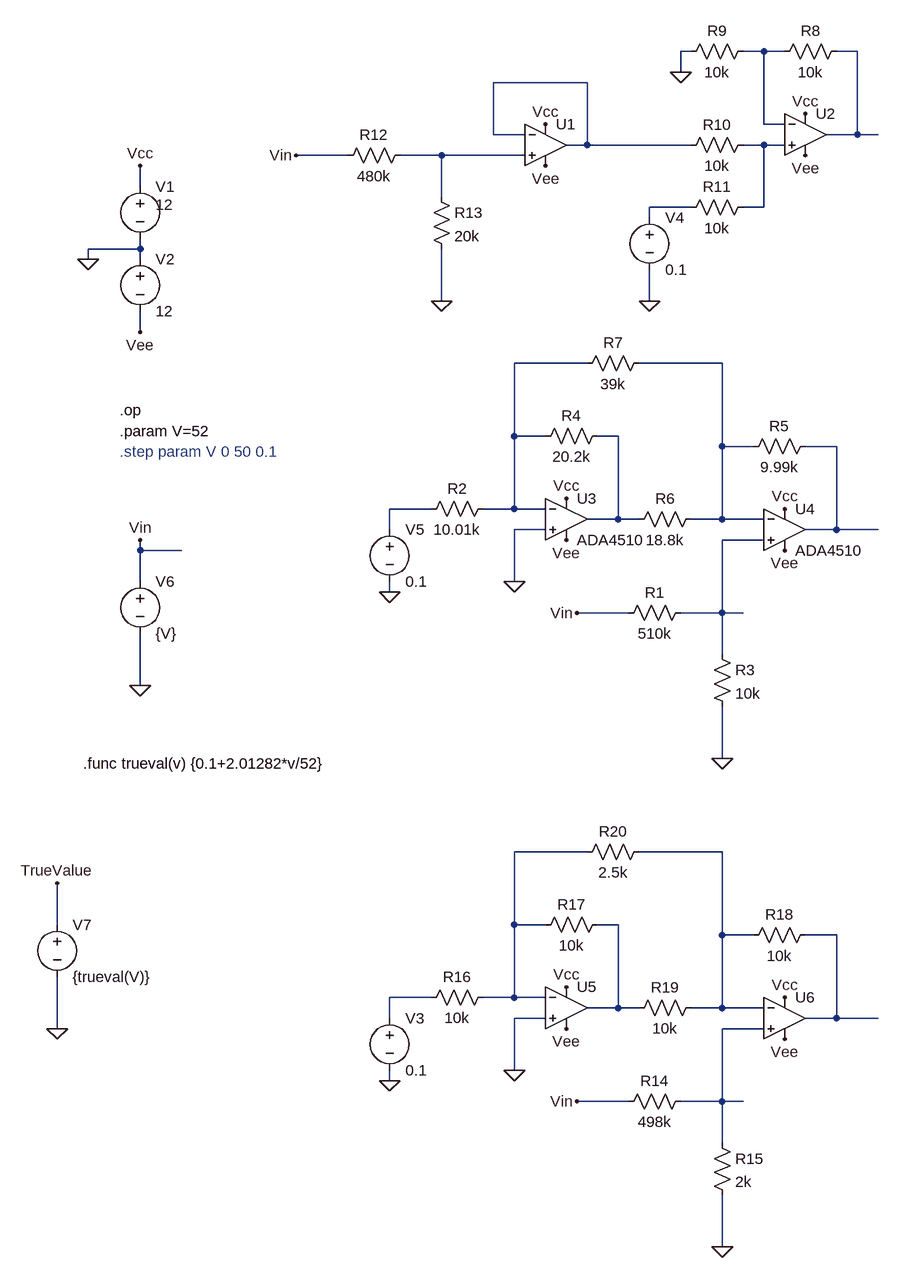
[diagram p0: schematic VoltMeas.asc]
VoltMeas.asc, the LTspice schematic file:
Version 4.1
SHEET 1 880 1684
WIRE -544 -176 -560 -176
WIRE -432 -176 -464 -176
WIRE -400 -176 -432 -176
WIRE -288 -176 -320 -176
WIRE -560 -144 -560 -176
WIRE -704 -128 -848 -128
WIRE -432 -64 -432 -176
WIRE -400 -64 -432 -64
WIRE -848 -48 -848 -128
WIRE -800 -48 -848 -48
WIRE -288 -48 -288 -176
WIRE -288 -48 -336 -48
WIRE -256 -48 -288 -48
WIRE -704 -32 -704 -128
WIRE -704 -32 -736 -32
WIRE -544 -32 -704 -32
WIRE -432 -32 -464 -32
WIRE -400 -32 -432 -32
WIRE -1072 -16 -1152 -16
WIRE -928 -16 -992 -16
WIRE -800 -16 -928 -16
WIRE -1392 32 -1392 0
WIRE -928 48 -928 -16
WIRE -544 64 -608 64
WIRE -432 64 -432 -32
WIRE -432 64 -464 64
WIRE -608 80 -608 64
WIRE -1392 128 -1392 112
WIRE -1392 128 -1472 128
WIRE -1472 144 -1472 128
WIRE -1392 144 -1392 128
WIRE -928 208 -928 128
WIRE -608 208 -608 160
WIRE -1392 256 -1392 224
WIRE -704 304 -816 304
WIRE -496 304 -624 304
WIRE -816 416 -816 304
WIRE -768 416 -816 416
WIRE -656 416 -688 416
WIRE -496 432 -496 304
WIRE -448 432 -496 432
WIRE -320 432 -368 432
WIRE -944 528 -1008 528
WIRE -816 528 -816 416
WIRE -816 528 -864 528
WIRE -768 528 -816 528
WIRE -656 544 -656 416
WIRE -656 544 -704 544
WIRE -624 544 -656 544
WIRE -496 544 -496 432
WIRE -496 544 -544 544
WIRE -432 544 -496 544
WIRE -1008 560 -1008 528
WIRE -768 560 -816 560
WIRE -320 560 -320 432
WIRE -320 560 -368 560
WIRE -256 560 -320 560
WIRE -432 576 -496 576
WIRE -1392 592 -1392 576
WIRE -1328 592 -1392 592
WIRE -1392 640 -1392 592
WIRE -816 640 -816 560
WIRE -1008 656 -1008 640
WIRE -640 688 -720 688
WIRE -496 688 -496 576
WIRE -496 688 -560 688
WIRE -464 688 -496 688
WIRE -496 752 -496 688
WIRE -1392 800 -1392 720
WIRE -496 912 -496 832
WIRE -704 1056 -816 1056
WIRE -496 1056 -624 1056
WIRE -1520 1168 -1520 1104
WIRE -816 1168 -816 1056
WIRE -768 1168 -816 1168
WIRE -656 1168 -688 1168
WIRE -496 1184 -496 1056
WIRE -448 1184 -496 1184
WIRE -320 1184 -368 1184
WIRE -944 1280 -1008 1280
WIRE -816 1280 -816 1168
WIRE -816 1280 -864 1280
WIRE -768 1280 -816 1280
WIRE -656 1296 -656 1168
WIRE -656 1296 -704 1296
WIRE -624 1296 -656 1296
WIRE -496 1296 -496 1184
WIRE -496 1296 -544 1296
WIRE -432 1296 -496 1296
WIRE -1008 1312 -1008 1280
WIRE -768 1312 -816 1312
WIRE -320 1312 -320 1184
WIRE -320 1312 -368 1312
WIRE -256 1312 -320 1312
WIRE -1520 1328 -1520 1248
WIRE -432 1328 -496 1328
WIRE -816 1392 -816 1312
WIRE -1008 1408 -1008 1392
WIRE -640 1440 -720 1440
WIRE -496 1440 -496 1328
WIRE -496 1440 -560 1440
WIRE -464 1440 -496 1440
WIRE -496 1504 -496 1440
WIRE -496 1664 -496 1584
FLAG -1472 144 0
FLAG -1392 0 Vcc
FLAG -1392 256 Vee
FLAG -768 -64 Vcc
FLAG -768 0 Vee
FLAG -496 912 0
FLAG -368 -80 Vcc
FLAG -368 -16 Vee
FLAG -560 -144 0
FLAG -608 208 0
FLAG -736 576 Vee
FLAG -400 592 Vee
FLAG -400 528 Vcc
FLAG -736 512 Vcc
FLAG -816 640 0
FLAG -1008 656 0
FLAG -1392 800 0
FLAG -928 208 0
FLAG -1392 576 Vin
FLAG -1152 -16 Vin
FLAG -720 688 Vin
FLAG -496 1664 0
FLAG -736 1328 Vee
FLAG -400 1344 Vee
FLAG -400 1280 Vcc
FLAG -736 1264 Vcc
FLAG -816 1392 0
FLAG -1008 1408 0
FLAG -720 1440 Vin
FLAG -1520 1104 TrueValue
FLAG -1520 1328 0
DATAFLAG -624 -32 ""
DATAFLAG -256 -48 ""
DATAFLAG -1328 592 ""
DATAFLAG -928 -16 ""
DATAFLAG -608 64 ""
DATAFLAG -256 560 ""
DATAFLAG -464 688 ""
DATAFLAG -1008 528 ""
DATAFLAG -256 1312 ""
DATAFLAG -464 1440 ""
DATAFLAG -1008 1280 ""
DATAFLAG -192 608 "V(truevalue)"
SYMBOL voltage -1392 16 R0
WINDOW 3 24 44 Left 2
WINDOW 123 0 0 Left 0
WINDOW 39 0 0 Left 0
SYMATTR Value 12
SYMATTR InstName V1
SYMBOL voltage -1392 128 R0
WINDOW 123 0 0 Left 0
WINDOW 39 0 0 Left 0
SYMATTR InstName V2
SYMATTR Value 12
SYMBOL res -544 672 R90
WINDOW 0 0 56 VBottom 2
WINDOW 3 32 56 VTop 2
SYMATTR InstName R1
SYMATTR Value 510k
SYMATTR SpiceLine tol=1
SYMBOL res -512 736 R0
SYMATTR InstName R3
SYMATTR Value 10k
SYMATTR SpiceLine tol=1
SYMBOL res -304 -192 R90
WINDOW 0 0 56 VBottom 2
WINDOW 3 32 56 VTop 2
SYMATTR InstName R8
SYMATTR Value 10k
SYMBOL res -448 -192 R90
WINDOW 0 0 56 VBottom 2
WINDOW 3 32 56 VTop 2
SYMATTR InstName R9
SYMATTR Value 10k
SYMBOL res -448 -48 R90
WINDOW 0 0 56 VBottom 2
WINDOW 3 32 56 VTop 2
SYMATTR InstName R10
SYMATTR Value 10k
SYMBOL res -448 48 R90
WINDOW 0 0 56 VBottom 2
WINDOW 3 32 56 VTop 2
SYMATTR InstName R11
SYMATTR Value 10k
SYMBOL voltage -608 64 R0
WINDOW 123 0 0 Left 0
WINDOW 39 0 0 Left 0
SYMATTR InstName V4
SYMATTR Value 0.1
SYMBOL Res -848 512 R90
WINDOW 0 0 56 VBottom 2
WINDOW 3 32 56 VTop 2
SYMATTR InstName R2
SYMATTR Value 10.01k
SYMBOL Res -672 400 R90
WINDOW 0 0 56 VBottom 2
WINDOW 3 32 56 VTop 2
SYMATTR InstName R4
SYMATTR Value 20.2k
SYMBOL Res -352 416 R90
WINDOW 0 0 56 VBottom 2
WINDOW 3 32 56 VTop 2
SYMATTR InstName R5
SYMATTR Value 9.99k
SYMBOL Res -528 528 R90
WINDOW 0 0 56 VBottom 2
WINDOW 3 32 56 VTop 2
SYMATTR InstName R6
SYMATTR Value 18.8k
SYMBOL Res -608 288 R90
WINDOW 0 0 56 VBottom 2
WINDOW 3 32 56 VTop 2
SYMATTR InstName R7
SYMATTR Value 39k
SYMBOL Voltage -1008 544 R0
SYMATTR InstName V5
SYMATTR Value 0.1
SYMBOL voltage -1392 624 R0
WINDOW 123 0 0 Left 0
WINDOW 39 0 0 Left 0
SYMATTR InstName V6
SYMATTR Value {V}
SYMBOL res -976 -32 R90
WINDOW 0 0 56 VBottom 2
WINDOW 3 32 56 VTop 2
SYMATTR InstName R12
SYMATTR Value 480k
SYMBOL res -944 32 R0
SYMATTR InstName R13
SYMATTR Value 20k
SYMBOL res -544 1424 R90
WINDOW 0 0 56 VBottom 2
WINDOW 3 32 56 VTop 2
SYMATTR InstName R14
SYMATTR Value 498k
SYMBOL res -512 1488 R0
SYMATTR InstName R15
SYMATTR Value 2k
SYMBOL Res -848 1264 R90
WINDOW 0 0 56 VBottom 2
WINDOW 3 32 56 VTop 2
SYMATTR InstName R16
SYMATTR Value 10k
SYMBOL Res -672 1152 R90
WINDOW 0 0 56 VBottom 2
WINDOW 3 32 56 VTop 2
SYMATTR InstName R17
SYMATTR Value 10k
SYMBOL Res -352 1168 R90
WINDOW 0 0 56 VBottom 2
WINDOW 3 32 56 VTop 2
SYMATTR InstName R18
SYMATTR Value 10k
SYMBOL Res -528 1280 R90
WINDOW 0 0 56 VBottom 2
WINDOW 3 32 56 VTop 2
SYMATTR InstName R19
SYMATTR Value 10k
SYMBOL Res -608 1040 R90
WINDOW 0 0 56 VBottom 2
WINDOW 3 32 56 VTop 2
SYMATTR InstName R20
SYMATTR Value 2.5k
SYMBOL Voltage -1008 1296 R0
SYMATTR InstName V3
SYMATTR Value 0.1
SYMBOL OpAmps/UniversalOpAmp1 -768 -32 R0
SYMATTR InstName U1
SYMATTR Value2 Avol=1Meg GBW=10Meg Vos=1
SYMBOL OpAmps/UniversalOpAmp1 -368 -48 R0
SYMATTR InstName U2
SYMATTR Value2 Avol=1Meg GBW=10Meg Vos=1
SYMBOL OpAmps/UniversalOpAmp1 -736 1296 R0
SYMATTR InstName U5
SYMBOL OpAmps/UniversalOpAmp1 -400 1312 R0
SYMATTR InstName U6
SYMBOL OpAmps/ADA4510 -736 480 R0
SYMATTR InstName U3
SYMBOL OpAmps/ADA4510 -400 496 R0
SYMATTR InstName U4
SYMBOL voltage -1520 1152 R0
WINDOW 123 0 0 Left 0
WINDOW 39 0 0 Left 0
SYMATTR InstName V7
SYMATTR Value {trueval(V)}
TEXT -1424 376 Left 2 !.op
TEXT -1480 920 Left 2 !.func trueval(v) {0.1+2.01282*v/52}
TEXT -1424 440 Left 2 ;.step param V 0 50 0.1
TEXT -1424 408 Left 2 !.param V=52

The netlist it stands for:
* VoltMeas.asc
V1 Vcc 0 12
V2 0 Vee 12
R1 N012 Vin 510k tol=1
R3 N012 0 10k tol=1
R8 N002 N001 10k
R9 N001 0 10k
R10 N004 N003 10k
R11 N004 N006 10k
V4 N006 0 0.1
R2 N007 N011 10.01k
R4 N009 N007 20.2k
R5 N010 N008 9.99k
R6 N008 N009 18.8k
R7 N008 N007 39k
V5 N011 0 0.1
V6 Vin 0 {V}
R12 N005 Vin 480k
R13 N005 0 20k
R14 N018 Vin 498k
R15 N018 0 2k
R16 N013 N017 10k
R17 N015 N013 10k
R18 N016 N014 10k
R19 N014 N015 10k
R20 N014 N013 2.5k
V3 N017 0 0.1
X§U1 N005 N003 Vcc Vee N003 level1 Avol=1Meg GBW=10Meg Vos=1 En=0 Enk=0 In=0 Ink=0 Rin=500Meg  ; pins In+ In- V+ V- OUT
X§U2 N004 N001 Vcc Vee N002 level1 Avol=1Meg GBW=10Meg Vos=1 En=0 Enk=0 In=0 Ink=0 Rin=500Meg  ; pins In+ In- V+ V- OUT
X§U5 0 N013 Vcc Vee N015 level1 Avol=1Meg GBW=10Meg Vos=0 En=0 Enk=0 In=0 Ink=0 Rin=500Meg  ; pins In+ In- V+ V- OUT
X§U6 N018 N014 Vcc Vee N016 level1 Avol=1Meg GBW=10Meg Vos=0 En=0 Enk=0 In=0 Ink=0 Rin=500Meg  ; pins In+ In- V+ V- OUT
X§U3 0 N007 Vcc Vee N009 ADA4510  ; pins In+ In- V+ V- OUT
X§U4 N012 N008 Vcc Vee N010 ADA4510  ; pins In+ In- V+ V- OUT
V7 TrueValue 0 {trueval(V)}
.op
.func trueval(v) {0.1+2.01282*v/52}
* .step param V 0 50 0.1
.param V=52
.lib UniversalOpAmp1.lib
.backanno
.end